# EAGLE design 2025-02-19_audio_board (EAGLE 9.6.2)

## Sheet 1 of 2
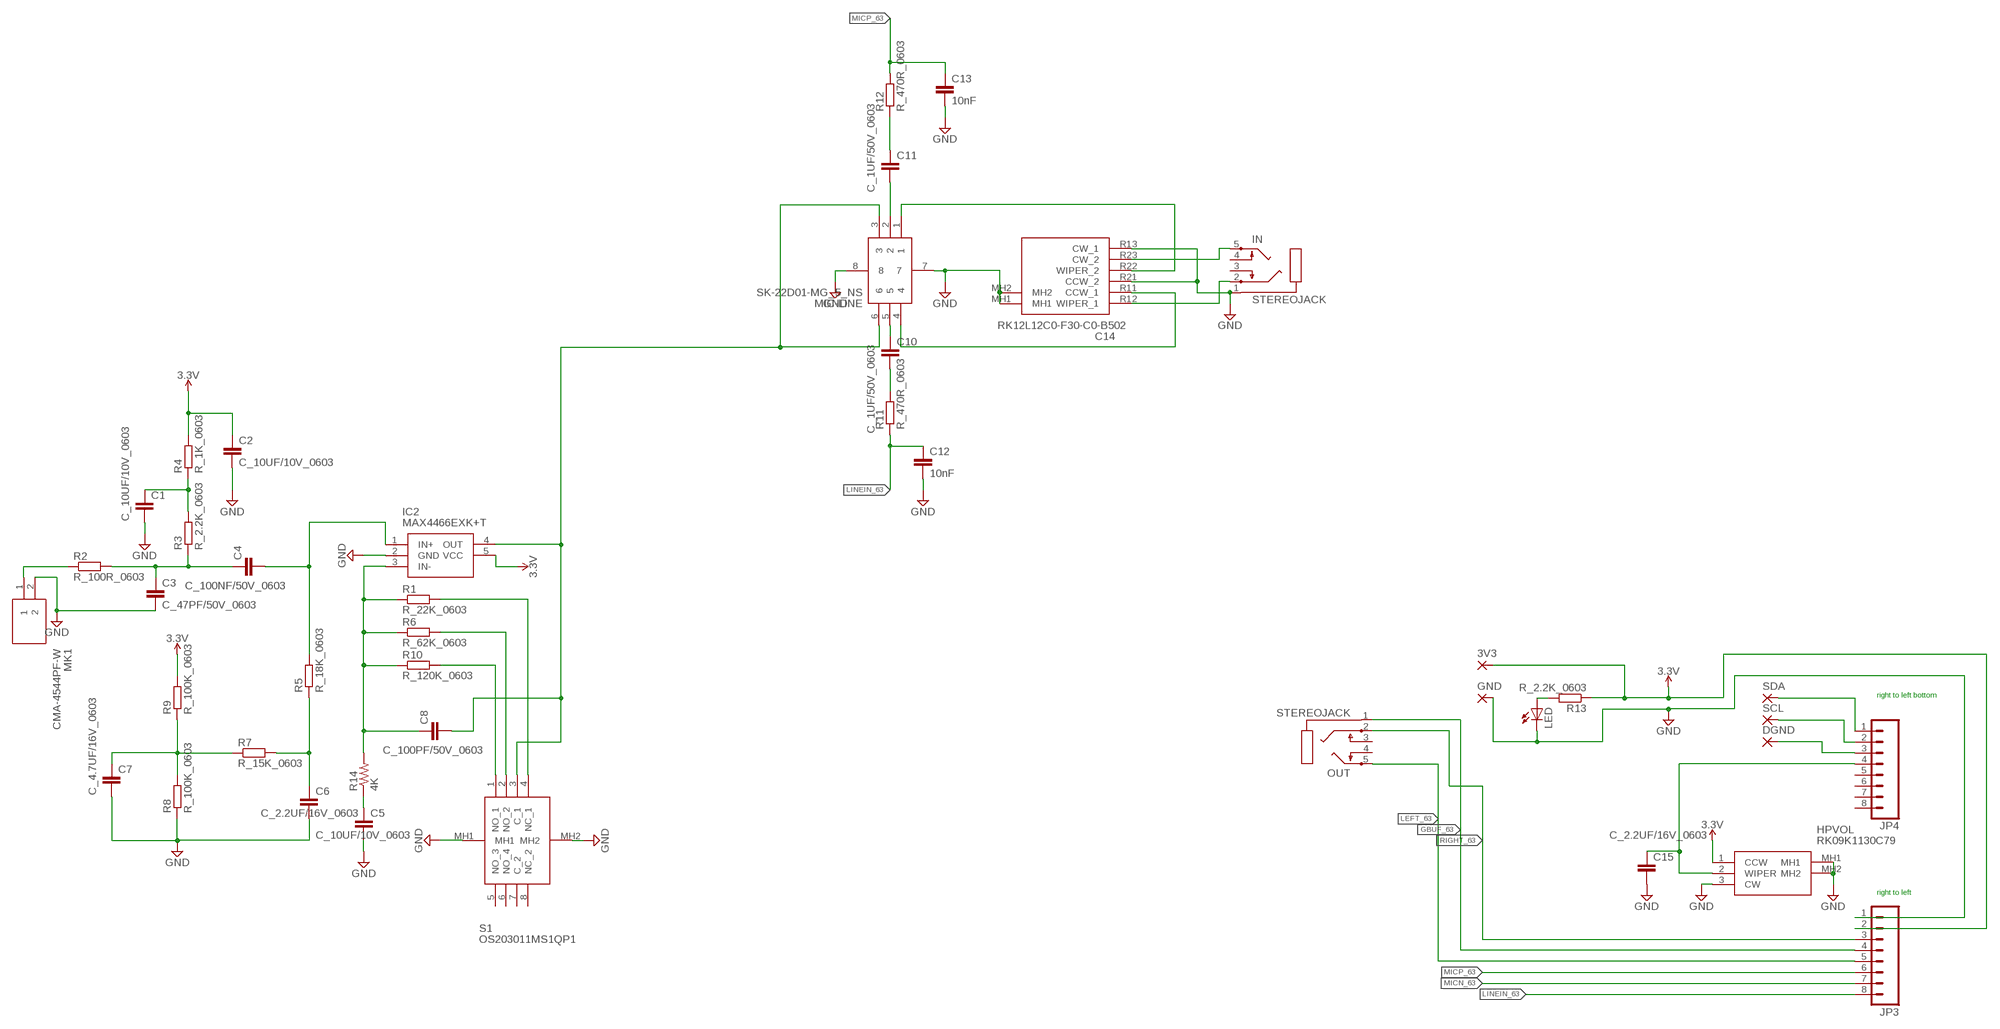
[diagram p0: schematic, sheet 1]

### Parts
3V3  2,54/1,0  [2,54/1,0]
C1  C_10UF/10V_0603  [C0603]
C2  C_10UF/10V_0603  [C0603]
C3  C_47PF/50V_0603  [C0603]
C4  C_100NF/50V_0603  [C0603]
C5  C_10UF/10V_0603  [C0603]
C6  C_2.2UF/16V_0603  [C0603]
C7  C_4.7UF/16V_0603  [C0603]
C8  C_100PF/50V_0603  [C0603]
C10  C_1UF/50V_0603  [C0603]
C11  C_1UF/50V_0603  [C0603]
C12  10nF  10NF-0603-50V-10%  [0603]
C13  10nF  10NF-0603-50V-10%  [0603]
C14  RK12L12C0-F30-C0-B502  [RK12L12C0F30C0B502]
C15  C_2.2UF/16V_0603  [C0603]
DGND  2,54/1,0  [2,54/1,0]
GND  2,54/1,0  [2,54/1,0]
HPVOL  RK09K1130C79  [RK09K1130C79]
IC2  MAX4466EXK+T  [SOT65P210X110-5N]
IN  STEREOJACK  [STX3100]
JP3  M08  [1X08_ROUND]
JP4  M08  [1X08_ROUND]
LED  LED  [SMARTLED-TTW]
MIC-LINE  SK-22D01-MG_5_NS  [SK22D01MG5NS]
MK1  CMA-4544PF-W  [CMA4544PFW]
OUT  STEREOJACK  [STX3100]
R1  R_22K_0603  [R0603]
R2  R_100R_0603  [R0603]
R3  R_2.2K_0603  [R0603]
R4  R_1K_0603  [R0603]
R5  R_18K_0603  [R0603]
R6  R_62K_0603  [R0603]
R7  R_15K_0603  [R0603]
R8  R_100K_0603  [R0603]
R9  R_100K_0603  [R0603]
R10  R_120K_0603  [R0603]
R11  R_470R_0603  [R0603]
R12  R_470R_0603  [R0603]
R13  R_2.2K_0603  [R0603]
R14  4K  R-US_R0603  [R0603]
S1  OS203011MS1QP1  [OS203011MS1QP1]
SCL  2,54/1,0  [2,54/1,0]
SDA  2,54/1,0  [2,54/1,0]

### Nets
3.3V: 3V3.1(P) C2.1 HPVOL.1(CCW) IC2.5(VCC) JP3.2 R4.2 R9.2 R13.1
GBUF_63: JP3.4 OUT.1
GND: C1.2 C2.2 C3.2 C5.2 C6.2 C7.2 C12.2 C13.2 C14.MH1 C14.MH2 C14.R13(CW_1) C14.R21(CCW_2) C15.2 GND.1(P) HPVOL.3(CW) HPVOL.MH1 HPVOL.MH2 IC2.2(GND) IN.1 JP3.1 LED.C@1(C) MIC-LINE.7 MIC-LINE.8 MK1.2 R8.1 S1.MH1 S1.MH2
LEFT_63: JP3.5 OUT.5
LINEIN_63: C12.1 JP3.8 R11.1
MICN_63: JP3.7
MICP_63: C13.1 JP3.6 R12.2
N$1: MK1.1 R2.1
N$2: C3.1 C4.1 R2.2 R3.1
N$3: LED.A@1(A) R13.2
N$4: C5.1 R14.1
N$5: C6.1 R5.1 R7.2
N$6: C1.1 R3.2 R4.1
N$7: C8.1 IC2.3(IN-) R1.1 R6.1 R10.1 R14.2
N$8: JP4.1 SDA.1(P)
N$9: JP4.2 SCL.1(P)
N$10: R1.2 S1.4(NC_1)
N$11: R6.2 S1.2(NO_2)
N$12: C11.2 MIC-LINE.2
N$13: R10.2 S1.1(NO_1)
N$14: C10.2 R11.2
N$15: C10.1 MIC-LINE.5
N$16: C14.R22(WIPER_2) MIC-LINE.1
N$17: C11.1 R12.1
N$18: C14.R23(CW_2) IN.5
N$19: DGND.1(P) JP4.3
N$20: C14.R12(WIPER_1) IN.2
N$21: C14.R11(CCW_1) MIC-LINE.4
N$22: C15.1 HPVOL.2(WIPER) JP4.4
OAIN: C4.2 IC2.1(IN+) R5.2
OAOUT: C8.2 IC2.4(OUT) MIC-LINE.3 MIC-LINE.6 S1.3(C_1)
RIGHT_63: JP3.3 OUT.2
VHALF: C7.1 R7.1 R8.2 R9.1
Unconnected: IN.3 IN.4 JP4.5 JP4.6 JP4.7 JP4.8 OUT.3 OUT.4 S1.5(NO_3) S1.6(NO_4) S1.7(C_2) S1.8(NC_2)

### Notes on the sheet
- right to left bottom
- right to left

## Sheet 2 of 2

## Library data of the parts
3V3 DGND GND SCL SDA = wirepad:2,54/1,0: THROUGH-HOLE PAD
C1 C2 C5 = JLC PCB Basic Parts_loc:C_: Capacitor General purpose SMD Capacitor; LCSC_DATASHEET: https://datasheet.lcsc.com/lcsc/1810191219_Samsung-Electro-Mechanics-CL10A106KP8NNNC_C19702.pdf; LCSC_PART: C19702; LCSC_ROTATION_CCW: 0; LCSC_STOCK: 2089400; PROPERTIES: 10V 10uF X5R ±10% 0603 ROHS
C3 = JLC PCB Basic Parts_loc:C_: Capacitor General purpose SMD Capacitor; LCSC_DATASHEET: https://datasheet.lcsc.com/lcsc/1810261610_Samsung-Electro-Mechanics-CL10C470JB8NNNC_C1671.pdf; LCSC_PART: C1671; LCSC_ROTATION_CCW: 0; LCSC_STOCK: 95931; PROPERTIES: 50V 47pF C0G ±5% 0603 ROHS
C4 = JLC PCB Basic Parts_loc:C_: Capacitor General purpose SMD Capacitor; LCSC_DATASHEET: https://datasheet.lcsc.com/lcsc/1809301912_YAGEO-CC0603KRX7R9BB104_C14663.pdf; LCSC_PART: C14663; LCSC_ROTATION_CCW: 0; LCSC_STOCK: 7111530; PROPERTIES: 50V 100nF X7R ±10% 0603 ROHS
C6 C15 = JLC PCB Basic Parts_loc:C_: Capacitor General purpose SMD Capacitor; LCSC_DATASHEET: https://datasheet.lcsc.com/lcsc/1810271109_Samsung-Electro-Mechanics-CL10A225KO8NNNC_C23630.pdf; LCSC_PART: C23630; LCSC_ROTATION_CCW: 0; LCSC_STOCK: 1324345; PROPERTIES: 16V 2.2uF X5R ±10% 0603 ROHS
C7 = JLC PCB Basic Parts_loc:C_: Capacitor General purpose SMD Capacitor; LCSC_DATASHEET: https://datasheet.lcsc.com/lcsc/1810261514_Samsung-Electro-Mechanics-CL10A475KO8NNNC_C19666.pdf; LCSC_PART: C19666; LCSC_ROTATION_CCW: 0; LCSC_STOCK: 2027167; PROPERTIES: 16V 4.7uF X5R ±10% 0603 ROHS
C8 = JLC PCB Basic Parts_loc:C_: Capacitor General purpose SMD Capacitor; LCSC_DATASHEET: https://datasheet.lcsc.com/lcsc/1811151136_Samsung-Electro-Mechanics-CL10C101JB8NNNC_C14858.pdf; LCSC_PART: C14858; LCSC_ROTATION_CCW: 0; LCSC_STOCK: 2152181; PROPERTIES: 50V 100pF C0G ±5% 0603 ROHS
C10 C11 = JLC PCB Basic Parts_loc:C_: Capacitor General purpose SMD Capacitor; LCSC_DATASHEET: https://datasheet.lcsc.com/lcsc/1810261812_Samsung-Electro-Mechanics-CL10A105KB8NNNC_C15849.pdf; LCSC_PART: C15849; LCSC_ROTATION_CCW: 0; LCSC_STOCK: 14650365; PROPERTIES: 50V 1uF X5R ±10% 0603 ROHS
C12 C13 = SparkFun-Capacitors:10NF: 0.01uF/10nF/10,000pF ceramic capacitors A capacitor is a passive two-terminal electrical component used to store electrical energy temporarily in an electric field. CAP-09321; PROD_ID: CAP-00867
C14 = RK12L12C0-F30-C0-B502:RK12L12C0-F30-C0-B502: Potentiometers 12MM Source: Datasheet <https://www.mouser.lu/datasheet/2/15/RK12L12_VARIETYOTHER-1370614.pdf>; DESCRIPTION: Potentiometers 12MM; HEIGHT: 30mm; MANUFACTURER_NAME: ALPS Electric; MANUFACTURER_PART_NUMBER: RK12L12C0-F30-C0-B502
HPVOL = RK09K1130C79:RK09K1130C79: ALPS? RK09K1130C79? Rotary Potentiometer, RK09 Series, 10 kohm, Linear, 1, 50 mW, Through Hole%0%0 Source: Datasheet <http://www.farnell.com/datasheets/317980.pdf>; DESCRIPTION: ALPS? RK09K1130C79? Rotary Potentiometer, RK09 Series, 10 kohm, Linear, 1, 50 mW, Through Hole%0%0; HEIGHT: 25.5mm; MANUFACTURER_NAME: ALPS Electric; MANUFACTURER_PART_NUMBER: RK09K1130C79
IC2 = MAX4466EXK+T:MAX4466EXK+T: Low-Cost, Micropower, SC70/SOT23-8, Microphone Preamplifiers with Complete Shutdown Source: Datasheet <https://www.analog.com/MAX4466/datasheet>; ARROW_PART_NUMBER: MAX4466EXK+T; ARROW_PRICE-STOCK: https://www.arrow.com/en/products/max4466exkt/analog-devices?region=nac; DESCRIPTION: Low-Cost, Micropower, SC70/SOT23-8, Microphone Preamplifiers with Complete Shutdown; HEIGHT: 1.1mm; MANUFACTURER_NAME: Analog Devices; MANUFACTURER_PART_NUMBER: MAX4466EXK+T; MOUSER_PART_NUMBER: 700-MAX4466EXKT; MOUSER_PRICE-STOCK: https://www.mouser.co.uk/ProductDetail/Analog-Devices-Maxim-Integrated/MAX4466EXK%2bT?qs=1eQvB6Dk1viIfH6l6v5sWg%3D%3D
IN OUT = adafruit:STEREOJACK: MIC/HEADPHONE JACK Stereo jack with two switches. Kycon STX3100, CUI SJ1-3555NG and/or 4UCon 05544
JP3 JP4 = PatternAgents-ProtoPads:M08: Header 8 Standard 8-pin 0.1" header
LED = adafruit:LED: LED OSRAM: - CHIPLED LG R971, LG N971, LY N971, LG Q971, LY Q971, LO R971, LY R971 LH N974, LH R974 LS Q976, LO Q976, LY Q976 LO Q996 - Hyper CHIPLED LW Q18S LB Q993, LB Q99A, LB R99A - SideLED LS A670, LO A670, LY A670, LG A670, LP A670 LB A673, LV A673, LT A673, LW A673 LH A674 LY A675 LS A676, LA A676, LO A676, LY A676, LW A676 LS A679, LY A679, LG A679 - Hyper Micro SIDELED® LS Y876, LA Y876, LO Y876, LY Y876 LT Y87S - SmartLED LW L88C, LW L88S LB L89C, LB L89S, LG L890 LS L89K, LO L89K, LY L89K LS L896, LA L896, LO L896, LY L896 - TOPLED LS T670, LO T670, LY T670, LG T670, LP T670 LSG T670, LSP T670, LSY T670, LOP T670, LYG T670 LG T671, LOG T671, LSG T671 LB T673, LV T673, LT T673, LW T673 LH T674 LS T676, LA T676, LO T676, LY T676, LB T676, LH T676, LSB T676, LW T676 LB T67C, LV T67C, LT T67C, LS T67K, LO T67K, LY T67K, LW E67C LS E67B, LA E67B, LO E67B, LY E67B, LB E67C, LV E67C, LT E67C LW T67C LS T679, LY T679, LG T679 LS T770, LO T770, LY T770, LG T770, LP T770 LB T773, LV T773, LT T773, LW T773 LH T774 LS E675, LA E675, LY E675, LS T675 LS T776, LA T776, LO T776, LY T776, LB T776 LHGB T686 LT T68C, LB T68C - Hyper Mini TOPLED® LB M676 - Mini TOPLED Santana® LG M470 LS M47K, LO M47K, LY M47K Source: http://www.osram.convergy.de/
MIC-LINE = SK-22D01-MG_5_NS:SK-22D01-MG_5_NS: Slide Switches DPDT 0.3 Amp at 30 V Source: Datasheet <https://www.ckswitches.com/media/1432/sk.pdf>; ARROW_PART_NUMBER: SK-22D01-MG 5 NS; ARROW_PRICE-STOCK: https://www.arrow.com/en/products/sk22d01mg5ns/ck?region=nac; DESCRIPTION: Slide Switches DPDT 0.3 Amp at 30 V; HEIGHT: 5.1mm; MANUFACTURER_NAME: C & K COMPONENTS; MANUFACTURER_PART_NUMBER: SK-22D01-MG 5 NS; MOUSER_PART_NUMBER: 611-SK-22D01-MG5NS; MOUSER_PRICE-STOCK: https://www.mouser.co.uk/ProductDetail/CK/SK-22D01-MG-5-NS?qs=T%252BgPUmif8%252Bj%2Ffo3NJcSFGw%3D%3D
MK1 = CMA-4544PF-W:CMA-4544PF-W: 9.7 mm, Omnidirectional, PCB Mount, 3.0 Vdc, Electret Condenser Microphone Source: Datasheet <https://www.sameskydevices.com/product/resource/supplyframepdf/cma-4544pf-w.pdf>; ARROW_PART_NUMBER: CMA-4544PF-W; ARROW_PRICE-STOCK: https://www.arrow.com/en/products/cma-4544pf-w/cui-devices?utm_currency=USD&region=nac; DESCRIPTION: 9.7 mm, Omnidirectional, PCB Mount, 3.0 Vdc, Electret Condenser Microphone; HEIGHT: 4.65mm; MANUFACTURER_NAME: Same Sky; MANUFACTURER_PART_NUMBER: CMA-4544PF-W; MOUSER_PART_NUMBER: 490-CMA-4544PF-W; MOUSER_PRICE-STOCK: https://www.mouser.co.uk/ProductDetail/Same-Sky/CMA-4544PF-W?qs=WyjlAZoYn50RZRL7clQhww%3D%3D
R1 = JLC PCB Basic Parts_loc:R_: Resistor General purpose SMD Resistor; LCSC_DATASHEET: https://datasheet.lcsc.com/lcsc/2110260230_UNI-ROYAL-Uniroyal-Elec-0603WAF2202T5E_C31850.pdf; LCSC_PART: C31850; LCSC_ROTATION_CCW: 0; LCSC_STOCK: 342507; PROPERTIES: ±1% 1/10W Thick Film Resistors 75V ±100ppm -55°C~+155°C 22kOhm 0603 ROHS
R2 = JLC PCB Basic Parts_loc:R_: Resistor General purpose SMD Resistor; LCSC_DATASHEET: https://datasheet.lcsc.com/lcsc/2110252030_UNI-ROYAL-Uniroyal-Elec-0603WAF1000T5E_C22775.pdf; LCSC_PART: C22775; LCSC_ROTATION_CCW: 0; LCSC_STOCK: 3700009; PROPERTIES: ±1% 1/10W Thick Film Resistors 75V ±200ppm -55°C~+155°C 100Ohm 0603 ROHS
R3 R13 = JLC PCB Basic Parts_loc:R_: Resistor General purpose SMD Resistor; LCSC_DATASHEET: https://datasheet.lcsc.com/lcsc/2110251730_UNI-ROYAL-Uniroyal-Elec-0603WAF2201T5E_C4190.pdf; LCSC_PART: C4190; LCSC_ROTATION_CCW: 0; LCSC_STOCK: 331536; PROPERTIES: ±1% 1/10W Thick Film Resistors 75V ±100ppm -55°C~+155°C 2.2kOhm 0603 ROHS
R4 = JLC PCB Basic Parts_loc:R_: Resistor General purpose SMD Resistor; LCSC_DATASHEET: https://datasheet.lcsc.com/lcsc/2110252030_UNI-ROYAL-Uniroyal-Elec-0603WAF1001T5E_C21190.pdf; LCSC_PART: C21190; LCSC_ROTATION_CCW: 0; LCSC_STOCK: 5175299; PROPERTIES: ±1% 1/10W Thick Film Resistors 75V ±100ppm -55°C~+155°C 1kOhm 0603 ROHS
R5 = JLC PCB Basic Parts_loc:R_: Resistor General purpose SMD Resistor; LCSC_DATASHEET: https://datasheet.lcsc.com/lcsc/2110260030_UNI-ROYAL-Uniroyal-Elec-0603WAF1802T5E_C25810.pdf; LCSC_PART: C25810; LCSC_ROTATION_CCW: 0; LCSC_STOCK: 156018; PROPERTIES: ±1% 1/10W Thick Film Resistors 75V ±100ppm -55°C~+155°C 18kOhm 0603 ROHS
R6 = JLC PCB Basic Parts_loc:R_: Resistor General purpose SMD Resistor; LCSC_DATASHEET: https://datasheet.lcsc.com/lcsc/2110252130_UNI-ROYAL-Uniroyal-Elec-0603WAF6202T5E_C23221.pdf; LCSC_PART: C23221; LCSC_ROTATION_CCW: 0; LCSC_STOCK: 19557; PROPERTIES: ±1% 1/10W Thick Film Resistors 75V ±100ppm -55°C~+155°C 62kOhm 0603 ROHS
R7 = JLC PCB Basic Parts_loc:R_: Resistor General purpose SMD Resistor; LCSC_DATASHEET: https://datasheet.lcsc.com/lcsc/2110252030_UNI-ROYAL-Uniroyal-Elec-0603WAF1502T5E_C22809.pdf; LCSC_PART: C22809; LCSC_ROTATION_CCW: 0; LCSC_STOCK: 394790; PROPERTIES: ±1% 1/10W Thick Film Resistors 75V ±100ppm -55°C~+155°C 15kOhm 0603 ROHS
R8 R9 = JLC PCB Basic Parts_loc:R_: Resistor General purpose SMD Resistor; LCSC_DATASHEET: https://datasheet.lcsc.com/lcsc/2110260030_UNI-ROYAL-Uniroyal-Elec-0603WAF1003T5E_C25803.pdf; LCSC_PART: C25803; LCSC_ROTATION_CCW: 0; LCSC_STOCK: 5826279; PROPERTIES: ±1% 1/10W Thick Film Resistors 75V ±100ppm -55°C~+155°C 100kOhm 0603 ROHS
R10 = JLC PCB Basic Parts_loc:R_: Resistor General purpose SMD Resistor; LCSC_DATASHEET: https://datasheet.lcsc.com/lcsc/2110260030_UNI-ROYAL-Uniroyal-Elec-0603WAF1203T5E_C25808.pdf; LCSC_PART: C25808; LCSC_ROTATION_CCW: 0; LCSC_STOCK: 362242; PROPERTIES: ±1% 1/10W Thick Film Resistors 75V ±100ppm -55°C~+155°C 120kOhm 0603 ROHS
R11 R12 = JLC PCB Basic Parts_loc:R_: Resistor General purpose SMD Resistor; LCSC_DATASHEET: https://datasheet.lcsc.com/lcsc/2110252130_UNI-ROYAL-Uniroyal-Elec-0603WAF4700T5E_C23179.pdf; LCSC_PART: C23179; LCSC_ROTATION_CCW: 0; LCSC_STOCK: 666559; PROPERTIES: ±1% 1/10W Thick Film Resistors 75V ±100ppm -55°C~+155°C 470Ohm 0603 ROHS
R14 = rcl:R-US_: RESISTOR, American symbol; SPICEPREFIX: R
S1 = OS203011MS1QP1:OS203011MS1QP1: Slide Switches DP3T On-On-On Source: Datasheet <https://www.ckswitches.com/media/1428/os.pdf>; ARROW_PART_NUMBER: OS203011MS1QP1; ARROW_PRICE-STOCK: https://www.arrow.com/en/products/os203011ms1qp1/ck?region=nac; DESCRIPTION: Slide Switches DP3T On-On-On; HEIGHT: 8mm; MANUFACTURER_NAME: C & K COMPONENTS; MANUFACTURER_PART_NUMBER: OS203011MS1QP1; MOUSER_PART_NUMBER: 611-OS203011MS1QP1; MOUSER_PRICE-STOCK: https://www.mouser.co.uk/ProductDetail/CK/OS203011MS1QP1?qs=vOb5o%2F429vPBgVy%2FFFX7mQ%3D%3D

## Board
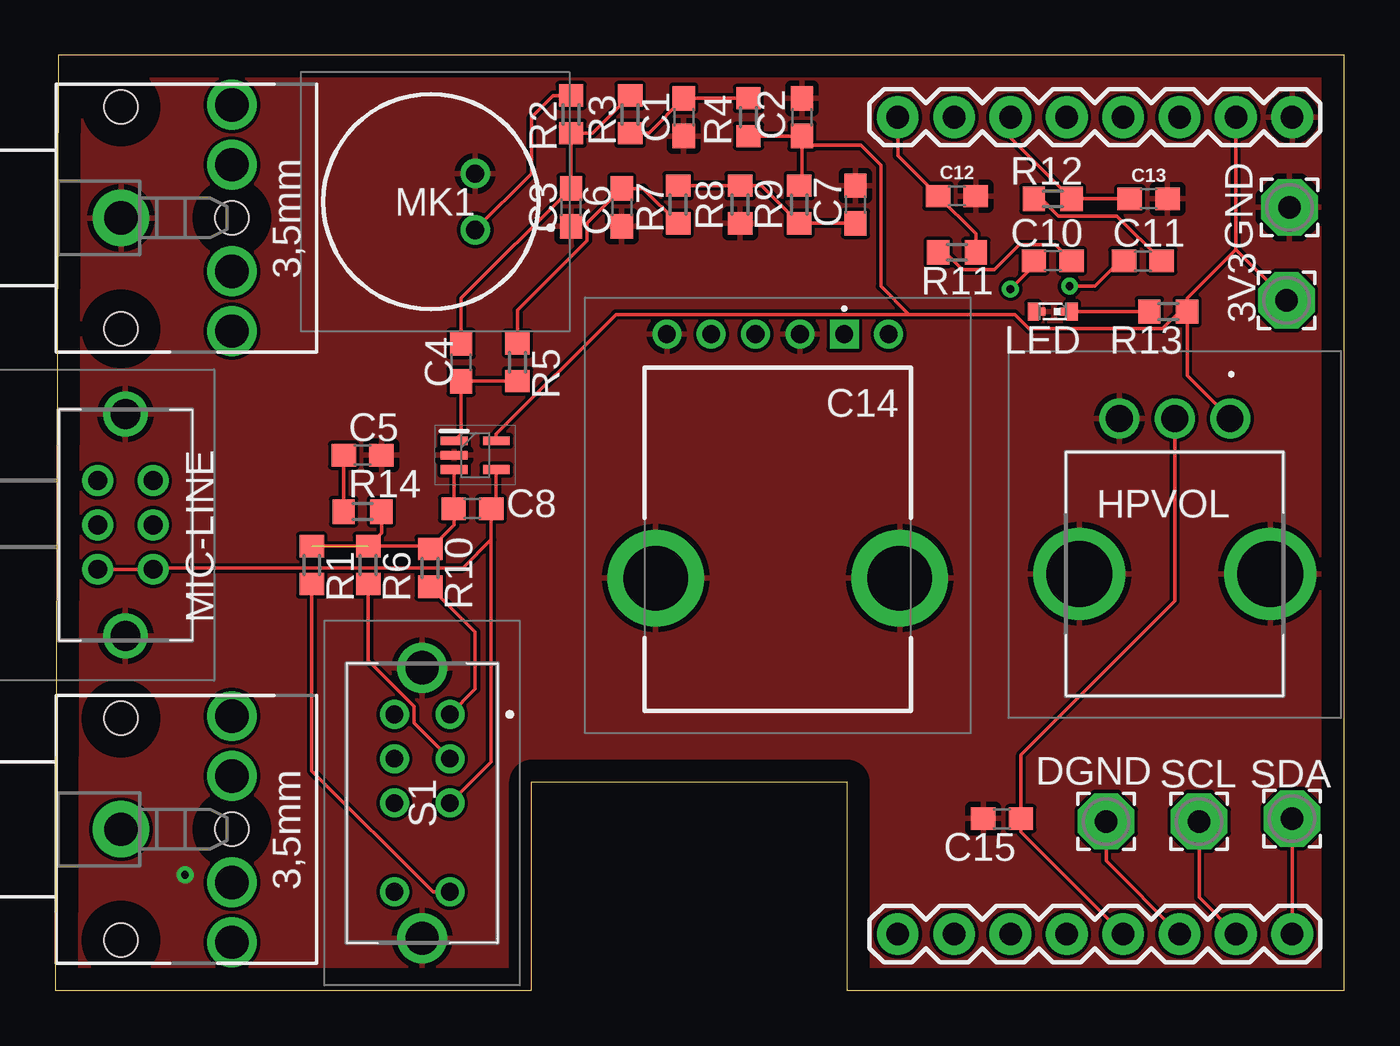
[diagram p1: board, top side]
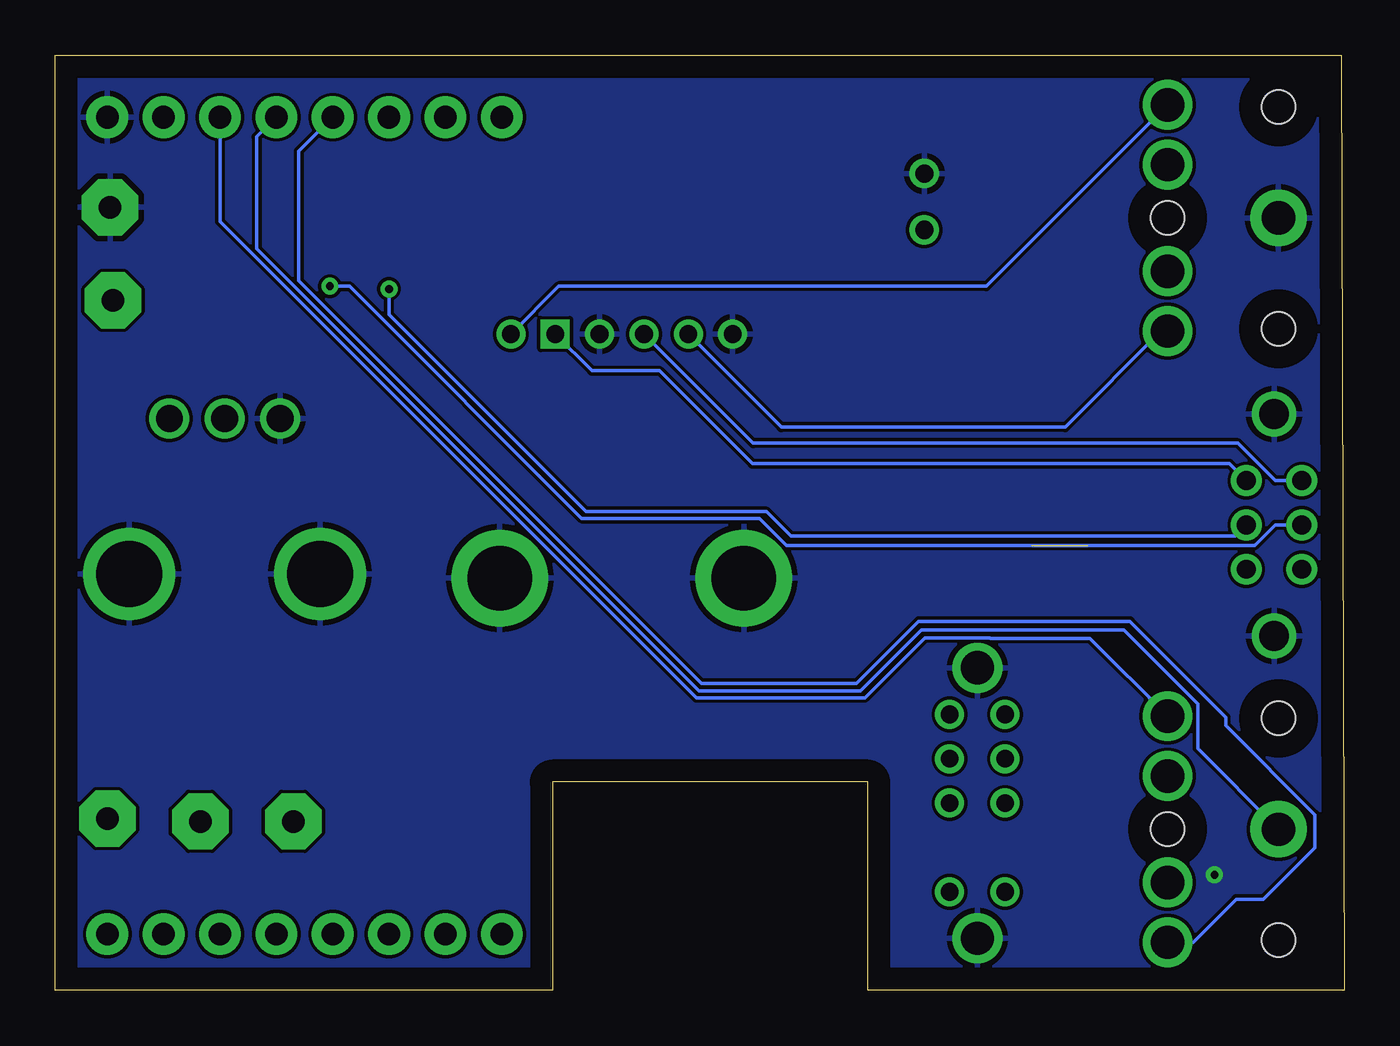
[diagram p2: board, bottom side, seen from below]

Size 58.09 x 42.15 mm. Coordinates in mm from the lower left corner, seen from the top.
Outline: 0,0 21.46,0 21.46,9.4 35.69,9.4 35.69,0 58.09,0 58.09,42.15 0.13,42.15 0,0
Copper layers (1*16): Top 0.035mm / dielectric 1.5mm / Bottom 0.035mm
Design rules "default": minimum track width 6mil, minimum drill 0.35mm, track to track 6mil, track to pad 6mil, pad to pad 6mil, via to via 6mil, smd to smd 6mil, copper to edge 40mil, drill to drill 6mil, minimum pad ring 10mil, minimum via ring 8mil, stop-mask expansion 4mil, vias tented up to drill 0mil, thermal gap 10mil

### Footprints (pad centres in the part's own frame; a part is rotated, then mirrored left to right if it is on the bottom)
2,54/1,0 = drill 1.016 pad 2.54 octagon: 1 0,0
C0603 = smd 1.1 x 1: 1 -0.85,0; 2 0.85,0
0603 = smd 1.1 x 1: 1 -0.85,0; 2 0.85,0
RK12L12C0F30C0B502 = drill 2.9 pad 4.35: MH1 -2.5,11; MH2 8.5,11 | drill 0.8 pad 1.3 square: R11 0,0 | drill 0.8 pad 1.3: R12 -2,0; R13 8,0; R21 2,0; R22 4,0; R23 6,0
RK09K1130C79 = drill 1.2 pad 1.8: 1 0,0; 2 2.5,0; 3 5,0 | drill 2.97 pad 4.155: MH1 -1.8,7; MH2 6.8,7
SOT65P210X110-5N = smd 1.2 x 0.4: 1 -0.95,0.65; 2 -0.95,0; 3 -0.95,-0.65; 4 0.95,-0.65; 5 0.95,0.65
STX3100 = drill 1.5 pad 2.54: 1 2.7,-0.1 | drill 1.5: 2 7.7,5; 3 7.7,2.3; 4 7.7,-2.5; 5 7.7,-5.2 | hole 1.5: 2.7,4.9; 2.7,-5.1; 7.7,-0.1
1X08_ROUND = drill 1.016 pad 1.88: 1 0,0; 2 2.54,0; 3 5.08,0; 4 7.62,0; 5 10.16,0; 6 12.7,0; 7 15.24,0; 8 17.78,0
SMARTLED-TTW = smd 0.8 x 0.5: A 0,-0.875; C 0,0.875 | smd 0.35 x 0.35: A@1 0,-0.5; C@1 0,0.5
SK22D01MG5NS = drill 0.85 pad 1.381: 1 0,0; 2 2,0; 3 4,0; 4 0,2.5; 5 2,2.5; 6 4,2.5 | drill 1.35 pad 2.025: 7 -3,1.25; 8 7,1.25
CMA4544PFW = drill 0.815 pad 1.333: 1 0,0; 2 0,2.54
R0603 = smd 1 x 1.1: 1 -0.85,0; 2 0.85,0
OS203011MS1QP1 = drill 0.8 pad 1.3: 1 0,0; 2 2,0; 3 4,0; 4 8,0; 5 0,-2.5; 6 2,-2.5; 7 4,-2.5; 8 8,-2.5 | drill 1.5 pad 2.25: MH1 -2.1,-1.25; MH2 10.1,-1.25

### Placement (x,y rotation side)
3V3  55.5,31.11 0 top
C1  28.32,39.37 270 top
C2  33.66,39.37 90 top
C3  23.24,35.31 270 top
C4  18.29,28.32 270 top
C5  13.84,24.13 0 top
C6  25.53,35.31 270 top
C7  36.07,35.43 90 top
C8  18.8,21.72 0 top
C10  44.96,32.89 0 top
C11  49.02,32.89 180 top
C12  40.64,35.81 0 top
C13  49.28,35.69 0 top
C14  35.56,29.59 180 top
C15  42.67,7.75 180 top
DGND  47.37,7.62 0 top
GND  55.63,35.31 0 top
HPVOL  52.96,25.78 180 top
IC2  18.92,24.13 0 top
IN  0.25,34.92 0 top
JP3  55.75,39.37 180 top
JP4  55.75,2.54 180 top
LED  44.96,30.61 90 top
MIC-LINE  1.91,22.99 270 top
MK1  18.92,34.29 0 top
OUT  0.25,7.37 0 top
R1  11.56,19.18 270 top
R2  23.24,39.5 270 top
R3  25.91,39.5 270 top
R4  31.24,39.37 270 top
R5  20.83,28.32 270 top
R6  14.1,19.18 270 top
R7  28.07,35.43 270 top
R8  30.86,35.43 90 top
R9  33.53,35.43 90 top
R10  16.89,19.05 270 top
R11  40.64,33.27 180 top
R12  44.96,35.69 0 top
R13  50.17,30.61 180 top
R14  13.84,21.59 0 top
S1  17.78,12.45 270 top
SCL  51.56,7.62 0 top
SDA  55.75,7.75 0 top

### Tracks (layer width: path | path; a pad name or v marks a point on that pad's centre or on a via)
3.3V
  Top 0.152: HPVOL.1 51.02,27.73 R13.1 | 3V3.1 53.21,33.4 | 53.21,33.4 JP3.2 | R13.1 51.02,31.2 53.21,33.4 | R13.1 50.69,30.61 49.91,29.83 43.89,29.83 43.24,30.47 38.48,30.47 | 38.48,30.47 25.27,30.47 19.87,25.08 IC2.5 | R4.2 C2.1 | R9.2 33.66,36.41 C2.1 | C2.1 34.08,38.1 36.32,38.1 37.21,37.21 37.21,31.74 38.48,30.47
GBUF_63
  Bottom 0.152: OUT.1 6.6,10.91 6.6,12.93 9.93,16.26 19.05,16.26 21.79,13.51 29.08,13.51 49.02,33.45 49.02,38.48 JP3.4
GND  (via drill 0.35)
  other vias: 5.84,5.21
  pour Top: -0.13,41.91 58.29,41.91 58.29,0 1.14,0 1.14,-0.71 -0.13,-0.99
  pour Bottom: -0.13,41.91 58.29,41.91 58.29,0 2.41,0 -0.13,-0.49
LEFT_63
  Bottom 0.152: JP3.5 47.12,37.85 47.12,32 28.96,13.84 21.97,13.84 19.18,16.64 9.65,16.64 5.33,12.32 5.33,11.94 1.32,7.92 1.32,6.43 3.64,4.11 4.86,4.11 6.8,2.17 OUT.5
LINEIN_63
  Top 0.152: 41.62,33.4 R11.1 41.49,34.11 C12.1 39.64,35.96 37.97,37.63 JP3.8
MICP_63
  Top 0.152: C13.1 R12.2 43.05,38.44 JP3.6
N$1
  Top 0.152: R2.1 22.73,40.35 22.44,40.35 21.46,39.37 21.46,36.83 MK1.1
N$2
  Top 0.152: R3.1 24.21,38.65 R2.2 C3.1 18.29,31.2 C4.1
N$3
  Top 0.152: LED.A@1 R13.2
N$4
  Top 0.152: R14.1 C5.1
N$5
  Top 0.152: R7.2 26.49,36.16 C6.1 23.97,34.6 23.97,33.81 20.83,30.67 R5.1
N$6
  Top 0.152: R4.1 C1.1 26.75,38.65 R3.2
N$7  (1 unrouted)
  Top 0.152: IC2.3 17.97,21.74 | 17.97,21.74 C8.1 17.91,21.68 | R1.1 16.76,20.03 R10.1 17.97,20.98 17.97,21.74 | R6.1 14.69,20.62 R14.2
N$8
  Top 0.152: JP4.1 SDA.1
N$9
  Top 0.152: JP4.2 51.56,4.19 SCL.1
N$10
  Top 0.152: R1.2 11.56,9.91 17.02,4.45 S1.4
N$11
  Top 0.152: S1.2 16.16,12.06 16.16,12.81 14.1,14.88 R6.2
N$12  (via drill 0.35)
  Top 0.152: C11.2 48.01,32.89 46.86,31.75 v45.72,31.75
  Bottom 0.152: MIC-LINE.2 3.11,20.99 4.02,20.07 25.14,20.07 26.36,21.29 34.37,21.29 44.83,31.75 v45.72,31.75
N$13
  Top 0.152: R10.2 18.92,16.17 18.92,13.59 S1.1
N$14
  Top 0.152: R11.2 40.12,33.27 40.89,32.49 42.34,32.49 43.46,33.62 45.08,33.62 C10.2
N$15  (via drill 0.35)
  Top 0.152: MIC-LINE.5 4.44,20.95 | C10.1 44.11,32.68 v43.05,31.62
  Bottom 0.152: MIC-LINE.5 4.91,20.48 24.92,20.48 26.04,21.59 34.16,21.59 43.05,30.48 v43.05,31.62 43.05,31.75
N$16
  Bottom 0.152: MIC-LINE.1 3.11,22.99 4.79,24.67 26.64,24.67 C14.R22
N$17
  Top 0.152: R12.1 44.44,35.69 45.21,34.91 47.86,34.91 C11.1
N$18
  Bottom 0.152: IN.5 8.25,29.73 12.57,25.4 25.37,25.4 C14.R23
N$19
  Top 0.152: JP4.3 47.37,5.84 DGND.1
N$20
  Bottom 0.152: IN.2 16.13,31.75 35.4,31.75 C14.R12
N$21
  Bottom 0.152: MIC-LINE.4 5.17,23.75 26.67,23.75 30.86,27.94 33.91,27.94 C14.R11
N$22
  Top 0.152: JP4.4 43.52,7.15 C15.1 43.52,10.63 50.46,17.57 HPVOL.2
OAIN
  Top 0.152: R5.2 C4.2 18.29,25.09 IC2.1
OAOUT
  Top 0.152: IC2.4 19.87,21.94 C8.2 19.65,20.32 | S1.3 19.65,10.31 19.65,20.32 | MIC-LINE.3 MIC-LINE.6 4.47,19.06 14.74,19.06 14.75,19.05 18.38,19.05 19.65,20.32
RIGHT_63
  Bottom 0.152: 8.78,13.19 OUT.2 11.46,15.88 15.95,15.88 15.97,15.9 18.9,15.9 21.61,13.19 29.19,13.19 50.67,34.67 JP3.3
VHALF
  Top 0.152: C7.1 R9.1 31.83,36.28 R8.2 R7.1